# Altium schematic sheet 12V_SIGNAL_BULKHEAD.SchDoc
size A4
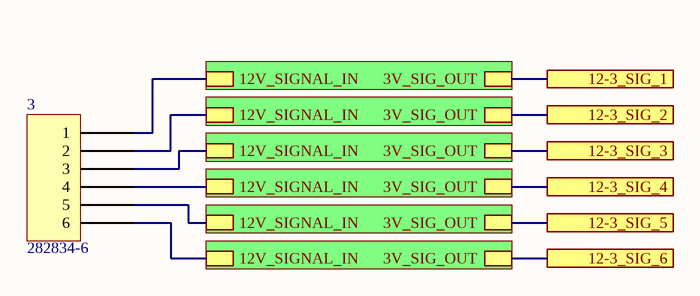
[diagram p0: 12V_SIGNAL_BULKHEAD.SchDoc]

## Parts
3  282834-6  [TE 282834-6]

## Sub-sheets
? = 12_TO_3V3_VOLTAGE_DIVIDER.SchDoc: 12V_SIGNAL_IN, 3V_SIG_OUT
? = 12_TO_3V3_VOLTAGE_DIVIDER.SchDoc: 12V_SIGNAL_IN, 3V_SIG_OUT
? = 12_TO_3V3_VOLTAGE_DIVIDER.SchDoc: 12V_SIGNAL_IN, 3V_SIG_OUT
? = 12_TO_3V3_VOLTAGE_DIVIDER.SchDoc: 12V_SIGNAL_IN, 3V_SIG_OUT
? = 12_TO_3V3_VOLTAGE_DIVIDER.SchDoc: 12V_SIGNAL_IN, 3V_SIG_OUT
? = 12_TO_3V3_VOLTAGE_DIVIDER.SchDoc: 12V_SIGNAL_IN, 3V_SIG_OUT

## Ports
12-3_SIG_1, 12-3_SIG_2, 12-3_SIG_3, 12-3_SIG_4, 12-3_SIG_5, 12-3_SIG_6

## Nets
12-3_SIG_1: port 12-3_SIG_1, sheet /3V_SIG_OUT
12-3_SIG_2: port 12-3_SIG_2, sheet /3V_SIG_OUT
12-3_SIG_3: port 12-3_SIG_3, sheet /3V_SIG_OUT
12-3_SIG_4: port 12-3_SIG_4, sheet /3V_SIG_OUT
12-3_SIG_5: port 12-3_SIG_5, sheet /3V_SIG_OUT
12-3_SIG_6: port 12-3_SIG_6, sheet /3V_SIG_OUT
Net3_1: 3.1 ; sheet /12V_SIGNAL_IN
Net3_2: 3.2 ; sheet /12V_SIGNAL_IN
Net3_3: 3.3 ; sheet /12V_SIGNAL_IN
Net3_4: 3.4 ; sheet /12V_SIGNAL_IN
Net3_5: 3.5 ; sheet /12V_SIGNAL_IN
Net3_6: 3.6 ; sheet /12V_SIGNAL_IN

## Library data of the parts
3 = 282834-6: TERM BLK 6P SIDE ENT 2.54MM PCB; Manufacturer: TE Connectivity AMP Connectors; Current: 10A; Mating Orientation: Horizontal with Board; Number of Levels: 1; Pitch: 0.100" (2.54mm); Positions Per Level: 6; Voltage: 150V; Wire Gauge: 16-30 AWG; Wire Termination: Screw - Rising Cage Clamp; Part Number: 282834-6; Color: Green; ComponentLink1Description: Datasheet; ComponentLink1URL: https://www.te.com/commerce/DocumentDelivery/DDEController?Action=srchrtrv&DocNm=282834&DocType=Customer+Drawing&DocLang=English; ComponentLink2Description: DigiKey Link; ComponentLink2URL: http://digikey.com/product-detail/en/te-connectivity-amp-connectors/282834-6/A98337-ND/1153267; LastUpdated: 2020-01-15 4:16:31 AM; Lifecycle Status: Active; Minimum Order: 1; Mounting Type: Through Hole; Packaging: Bulk; Part Status: Active; Price: 4.72; Series: Buchanan; Supplier 1: DigiKey; Supplier Part Number 1: A98337-ND